# Altium schematic sheet WiF14Tao.SchDoc
size A4
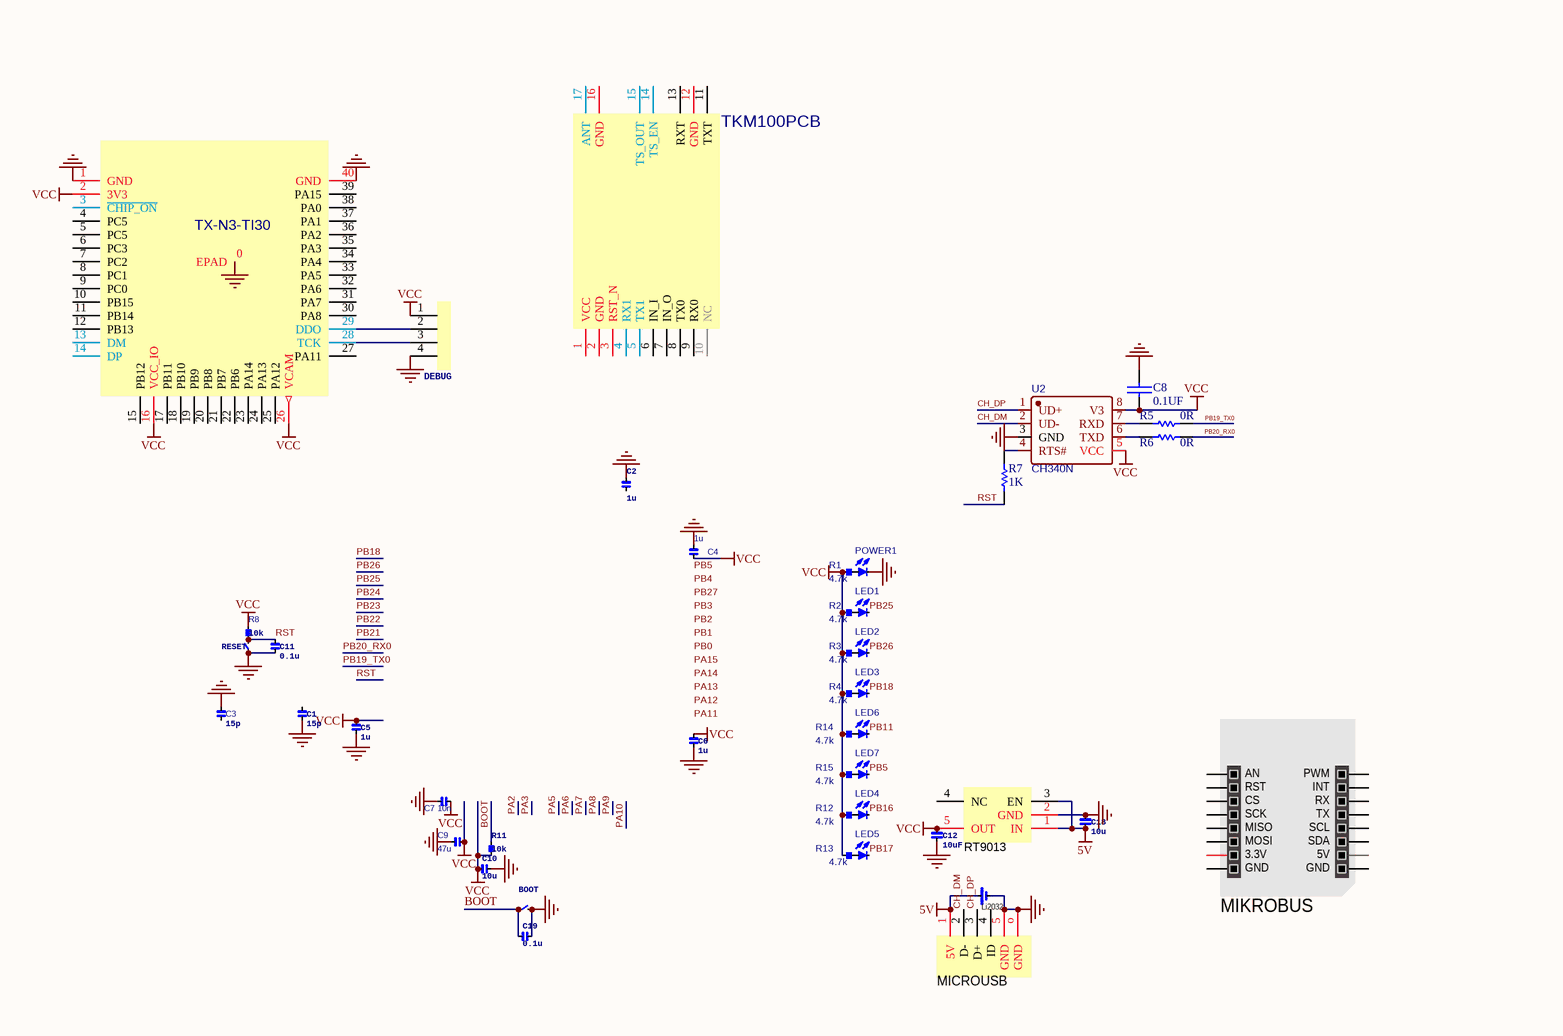
[diagram p0: WiF14Tao.SchDoc]

## Parts
BOOT  (no value)
C1  15p  [0603]
C2  1u  [0603]
C3  15p  [0603]
C4  1u  [0603]
C5  1u  [0603]
C6  1u  [0603]
C7  10n  [0603]
C8  0.1UF  [C 0603_L]
C9  47u  [0805]
C10  10u  [0603]
C11  0.1u  [0603]
C12  10uF  [1206]
C18  10u  [1206]
C19  0.1u  [0603]
DEBUG  DEBUG  (value not drawn)
LED1  (no value)  [0603]
LED2  (no value)  [0603]
LED3  (no value)  [0603]
LED4  (no value)  [0603]
LED5  (no value)  [0603]
LED6  (no value)  [0603]
LED7  (no value)  [0603]
Li2032  (no value)
MICROUSB  (no value)  [MICROUSB]
MIKROBUS  (no value)  [MIKROBUS]
POWER1  (no value)  [0603]
R1  4.7k  [0603]
R2  4.7k  [0603]
R3  4.7k  [0603]
R4  4.7k  [0603]
R5  0R  [R 0603_L]
R6  0R  [R 0603_L]
R7  1K  [R 0603_L]
R8  10k  [0603]
R11  10k  [0603]
R12  4.7k  [0603]
R13  4.7k  [0603]
R14  4.7k  [0603]
R15  4.7k  [0603]
RESET  (no value)
RT9013  (no value)  [SGM2028]
TKM100PCB  (no value)
TX-N3-TI30  TX-N3-TI30  (value not drawn)
U2  CH340N  [SOP8_L]

## Nets
5V: C18.1 Li2032.1 MICROUSB.1(5V) RT9013.1(IN) RT9013.3(EN)
GND: BOOT.2 C1.2 C2.2 C3.2 C4.1 C5.2 C6.2 C7.1 C8.1 C9.2 C10.2 C11.2 C12.2 C18.2 C19.2 DEBUG.4 Li2032.2 MICROUSB.5(GND) MICROUSB.o(GND) POWER1.2 RESET.1 RT9013.2(GND) TX-N3-TI30.0(EPAD) TX-N3-TI30.1(GND) TX-N3-TI30.40(GND) U2.3(GND)
VCC: C4.2 C5.1 C6.1 C7.2 C8.2 C9.1 C10.1 C12.1 DEBUG.1 R1.2 R2.2 R3.2 R4.2 R8.1 R11.1 R12.2 R13.2 R14.2 R15.2 RT9013.5(OUT) TX-N3-TI30.2(3V3) TX-N3-TI30.16(VCC_IO) TX-N3-TI30.26(VCAM) U2.5(VCC) U2.8(V3)
BOOT: BOOT.1 C19.1 R11.2
CH_DM: MICROUSB.2(D-) U2.2(UD-)
CH_DP: MICROUSB.3(D+) U2.1(UD+)
PB5: LED7.2
PB11: LED6.2
PB16: LED4.2
PB17: LED5.2
PB18: LED3.2
PB19_TX0: R5.2
PB20_RX0: R6.2
PB25: LED1.2
PB26: LED2.2
RST: C11.1 R7.1 R8.2 RESET.2
NetDEBUG_2: DEBUG.2 TX-N3-TI30.29(DDO)
NetDEBUG_3: DEBUG.3 TX-N3-TI30.28(TCK)
NetLED1_1: LED1.1 R2.1
NetLED2_1: LED2.1 R3.1
NetLED3_1: LED3.1 R4.1
NetLED4_1: LED4.1 R12.1
NetLED5_1: LED5.1 R13.1
NetLED6_1: LED6.1 R14.1
NetLED7_1: LED7.1 R15.1
NetPOWER1_1: POWER1.1 R1.1
NetR5_1: R5.1 U2.7(RXD)
NetR6_1: R6.1 U2.6(TXD)
NetR7_2: R7.2 U2.4(RTS#)

Not connected (* = marked no-connect by the designer): C1 1; C2 1; C3 1; MICROUSB 4(ID); MIKROBUS 1(AN) 2(RST) 3(CS) 4(SCK) 5(MISO) 6(MOSI) 7(3.3V) 8(GND) 9(GND) 10(5V) 11(SDA) 12(SCL) 13(TX) 14(RX) 15(INT) 16(PWM); RT9013 4(NC); TKM100PCB 1(VCC) 2(GND) 3(RST_N) 4(RX1) 5(TX1) 6(IN_I) 7(IN_O) 8(TX0) 9(RX0) 10(NC) 11(TXT) 12(GND) 13(RXT) 14(TS_EN) 15(TS_OUT) 16(GND) 17(ANT); TX-N3-TI30 3(~{CHIP_ON}) 4(PC5) 5(PC5) 6(PC3) 7(PC2) 8(PC1) 9(PC0) 10(PB15) 11(PB14) 12(PB13) 13(DM) 14(DP) 15(PB12) 17(PB11) 18(PB10) 19(PB9) 20(PB8) 21(PB7) 22(PB6) 23(PA14) 24(PA13) 25(PA12) 27(PA11) 30(PA8) 31(PA7) 32(PA6) 33(PA5) 34(PA4) 35(PA3) 36(PA2) 37(PA1) 38(PA0) 39(PA15)

## Notes on the sheet
- Labels drawn without touching a wire or pin: PA11, PA12, PA13, PA14, PA15, PB0, PB1, PB2, PB3, PB4, PB5, PB27

## Library data of the parts
BOOT RESET = key
C1-C7 C9-C12 C18 C19 = C
C8 = CAP: Capacitor
LED1-LED7 POWER1 = LED0
Li2032 = Li2032
MICROUSB = MICROUSB
MIKROBUS = MIKROBUS
R1-R4 R8 R11-R15 = R
R5-R7 = Res1: Resistor; Published: 8-Jun-2000; LatestRevisionDate: 17-Jul-2002; LatestRevisionNote: Re-released for DXP Platform.; PackageReference: AXIAL-0.3; Publisher: Altium Limited
  R5 R6: Value: 0R
  R7: Value: 1K
RT9013 = SGM2028
TKM100PCB = TKM100PCB
U2 = CH340N: BOM_Manufacturer: WCH(Jiangsu Qin Heng); Contributor: LCSC; BOM_Supplier: LCSC; BOM_Supplier Part: C506813; BOM_Manufacturer Part: CH340N; BOM_JLCPCB Part Class: Extended Part; spicePre: U; spiceSymbolName: CH340N